# Altium schematic sheet Sheet1.SchDoc
size A4
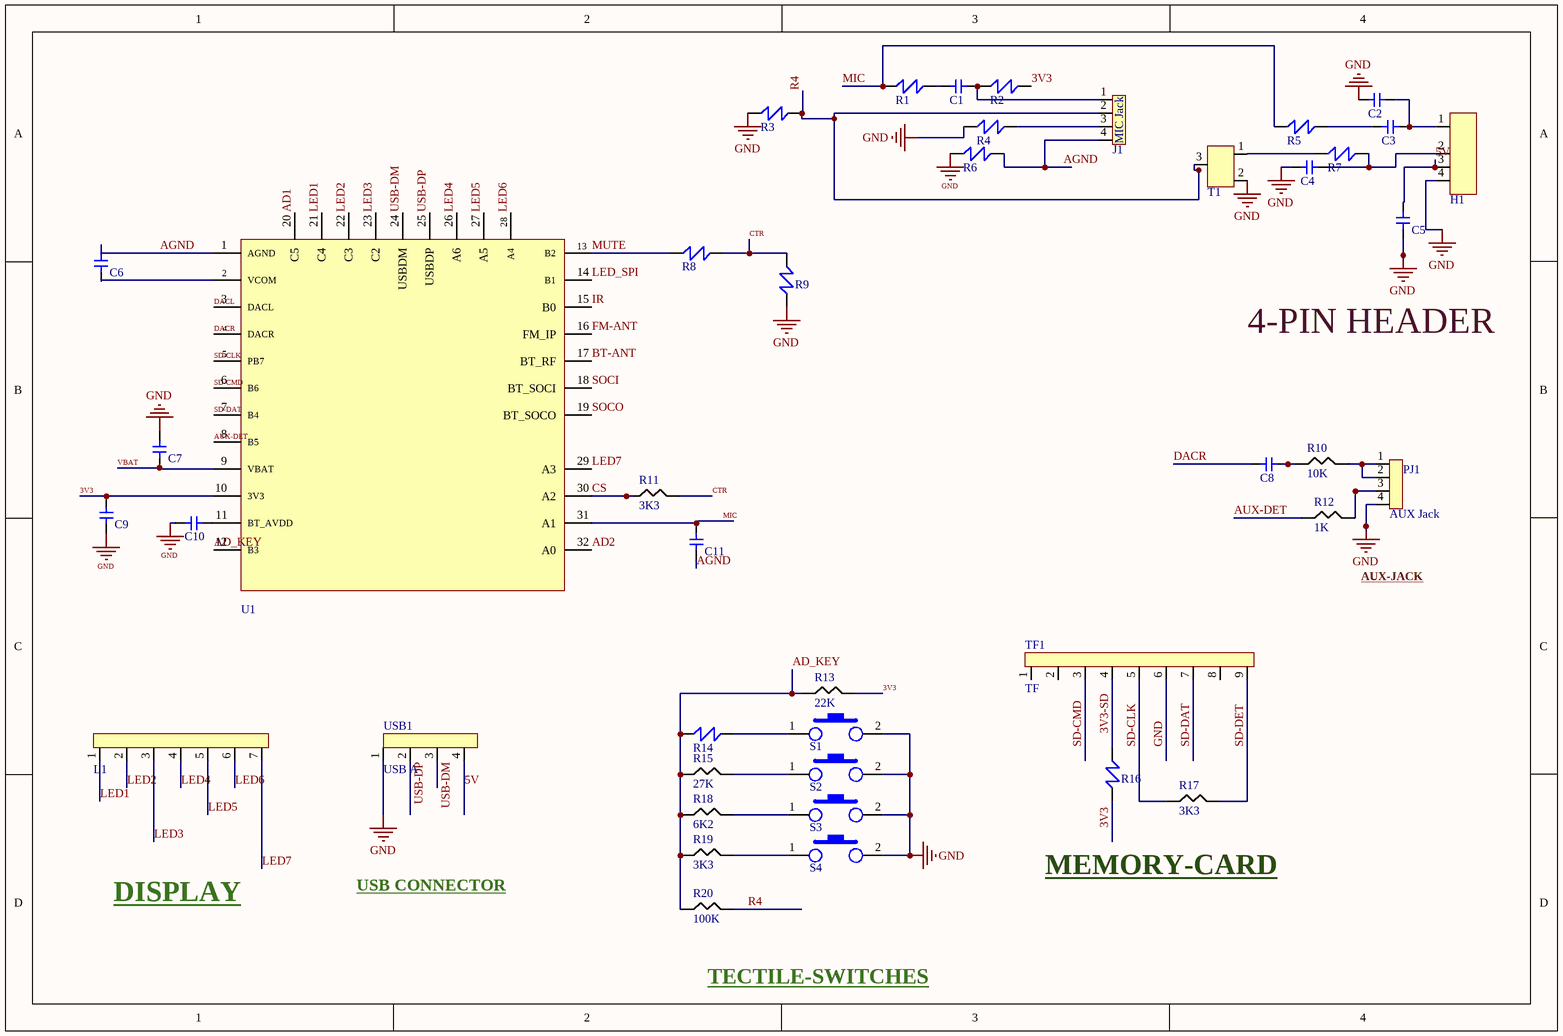
[diagram p0: Sheet1.SchDoc]

## Parts
C1  220nF  [CAP 220nF]  (value not drawn)
C2  10nf  [CAP 10nF]  (value not drawn)
C3  220nF  [CAP 220nF]  (value not drawn)
C4  100nF  [CAP 220nF]  (value not drawn)
C5  1uF  [CAPM 1uF]  (value not drawn)
C6  1uF  [CAP 10nF]  (value not drawn)
C7  1uF  [CAP 10nF]  (value not drawn)
C8  1uF  [CAPM 1uF]  (value not drawn)
C9  1uF  [CAP 10nF]  (value not drawn)
C10  1uF  [CAP 10nF]  (value not drawn)
C11  10uF  [CAP 10nF]  (value not drawn)
H1  HEADER  [Header4]  (value not drawn)
J1  MIC Jack  [MIC]  (value not drawn)
L1  LED_DISPLAY_3308  [LED_DISPLAY_3308]  (value not drawn)
PJ1  AUX Jack  [AUX]
R1  4.7K  [R_4.7K]  (value not drawn)
R2  22K  [R_22K]  (value not drawn)
R3  NC  [R_NC]  (value not drawn)
R4  NC  [R_NC]  (value not drawn)
R5  4.7K  [R_4.7K]  (value not drawn)
R6  0R  [R_0]  (value not drawn)
R7  6k8  [R_22K]  (value not drawn)
R8  91K  [R_22K]  (value not drawn)
R9  68K  [R_22K]  (value not drawn)
R10  10K  [R_10K]
R11  3K3  [R_100K]
R12  1K  [R_1K SECOND]
R13  22K  [R_22K]
R14  0R  [R_0]  (value not drawn)
R15  27K  [R_27K]
R16  4.7K  [R_4.7K]  (value not drawn)
R17  3K3  [R_100K]
R18  6K2  [R_6K2]
R19  3K3  [R_100K]
R20  100K  [R_100K]
S1  Teak switch  [teak switch]  (value not drawn)
S2  Teak switch  [teak switch]  (value not drawn)
S3  Teak switch  [teak switch]  (value not drawn)
S4  Teak switch  [teak switch]  (value not drawn)
T1  Transistor  [transisotr]  (value not drawn)
TF1  TF  [SD CARD]
U1  AC6966  [AC6966]  (value not drawn)
USB1  USB A  [USB A]

## Nets
GND: C2.1 C4.1 C5.2 C7.2 C9.1 C10.1 H1.4 PJ1.4 R3.1 R4.1 R6.1 R9.1 S1.2 S2.2 S3.2 S4.2 T1.2 TF1.6 USB1.1
3V3: C9.2 R2.2 R13.1 R16.1 U1.10(3V3)
3V3-SD: R16.2 TF1.4
5V: C5.1 H1.3 USB1.4
AD1: U1.20(C5)
AD2: U1.32(A0)
AD_KEY: R13.2 R14.1 R15.2 R18.2 R19.2 R20.2 U1.12(B3)
AGND: C6.2 C11.1 J1.4 R6.2 U1.1(AGND)
AUX-DET: R12.2 U1.8(B5)
BT-ANT: U1.17(BT_RF)
CS: R11.2 U1.30(A2)
CTR: R8.2 R9.2 R11.1
DACL: U1.3(DACL)
DACR: C8.1 U1.4(DACR)
FM-ANT: U1.16(FM_IP)
IR: U1.15(B0)
LED1: L1.1 U1.21(C4)
LED2: L1.2 U1.22(C3)
LED3: L1.3 U1.23(C2)
LED4: L1.4 U1.26(A6)
LED5: L1.5 U1.27(A5)
LED6: L1.6 U1.28(A4)
LED7: L1.7 U1.29(A3)
LED_SPI: U1.14(B1)
MIC: C11.2 R1.1 R5.1 U1.31(A1)
MUTE: R8.1 U1.13(B2)
R4: J1.2 R3.2 R20.1 T1.3
SD-CLK: R17.2 TF1.5 U1.5(PB7)
SD-CMD: TF1.3 U1.6(B6)
SD-DAT: TF1.7 U1.7(B4)
SD-DET: R17.1 TF1.9
SOCI: U1.18(BT_SOCI)
SOCO: U1.19(BT_SOCO)
USB-DM: U1.24(USBDM) USB1.3
USB-DP: U1.25(USBDP) USB1.2
VBAT: C7.1 U1.9(VBAT)
NetC1_1: C1.1 R1.2
NetC1_2: C1.2 J1.1 R2.1
NetC2_2: C2.2 C3.2 H1.1
NetC3_1: C3.1 R5.2
NetC4_2: C4.2 H1.2 R7.2
NetC6_1: C6.1 U1.2(VCOM)
NetC8_2: C8.2 R10.2
NetC10_2: C10.2 U1.11(BT_AVDD)
NetJ1_3: J1.3 R4.2
NetPJ1_1: PJ1.1 PJ1.2 R10.1
NetPJ1_3: PJ1.3 R12.1
NetR7_1: R7.1 T1.1
NetR14_2: R14.2 S1.1
NetR15_1: R15.1 S2.1
NetR18_1: R18.1 S3.1
NetR19_1: R19.1 S4.1

Not connected (* = marked no-connect by the designer): TF1 1 2 8

## Notes on the sheet
- 4-PIN HEADER
- AUX-JACK
- DISPLAY
- USB CONNECTOR
- MEMORY-CARD
- TECTILE-SWITCHES

## Library data of the parts
C1 C3 = CAP_2: 220nf SMD Capcitor
C2 = CAP_1: 10nf SMD Capcitor
C4 = CAP_3: 100nf SMD Capcitor
C5-C10 = CAP_4: 1uF SMD Capcitor
C11 = CAP_5: 10uF SMD Capcitor
H1 = HEADER: 4PIN HEADER
J1 = MIC
L1 = DISPLAY: LED_DISPLAY/3308
PJ1 = JACK 3.5MM: AUX Jack, 3.5mm
R1 R5 R16 = RES_1: 4.7K SMD Resistance
R2 = RES: 22K SMD Resistance
R3 R4 = RES_3
R6 R14 = RES_4: 0R SMD Resistance
R7 = RES_2: 6k8 SMD Resistance
R8 = RES_18: 91K SMD Resistance
R9 = RES_17: 68K SMD Resistance
R10 = RES_11: 10K, SMD Resistance / 1% / 125mW / VISHAY; Category: Resistors
R11 R17 R19 = RES_7: 3K3, SMD Resistance / 1% / 125mW / VISHAY; Category: Resistors
R12 = RES_5: 1K, SMD Resistance / 1% / 125mW / VISHAY; Category: Resistors
R13 = RES_10: 22K, SMD Resistance / 1% / 125mW / VISHAY; Category: Resistors
R15 = RES_9: 27K, SMD Resistance / 1% / 125mW / VISHAY; Category: Resistors
R18 = RES_8: 6K2, SMD Resistance / 1% / 125mW / VISHAY; Category: Resistors
R20 = RES_6: 100K, SMD Resistance / 1% / 125mW / VISHAY; Category: Resistors
S1-S4 = Switch
T1 = Transistor: 1AM
TF1 = TF card: TF Card, SD Card
USB1 = USB